# Altium schematic sheet Overview.SchDoc
size A3; SheetNumber: 1; SheetTotal: 20
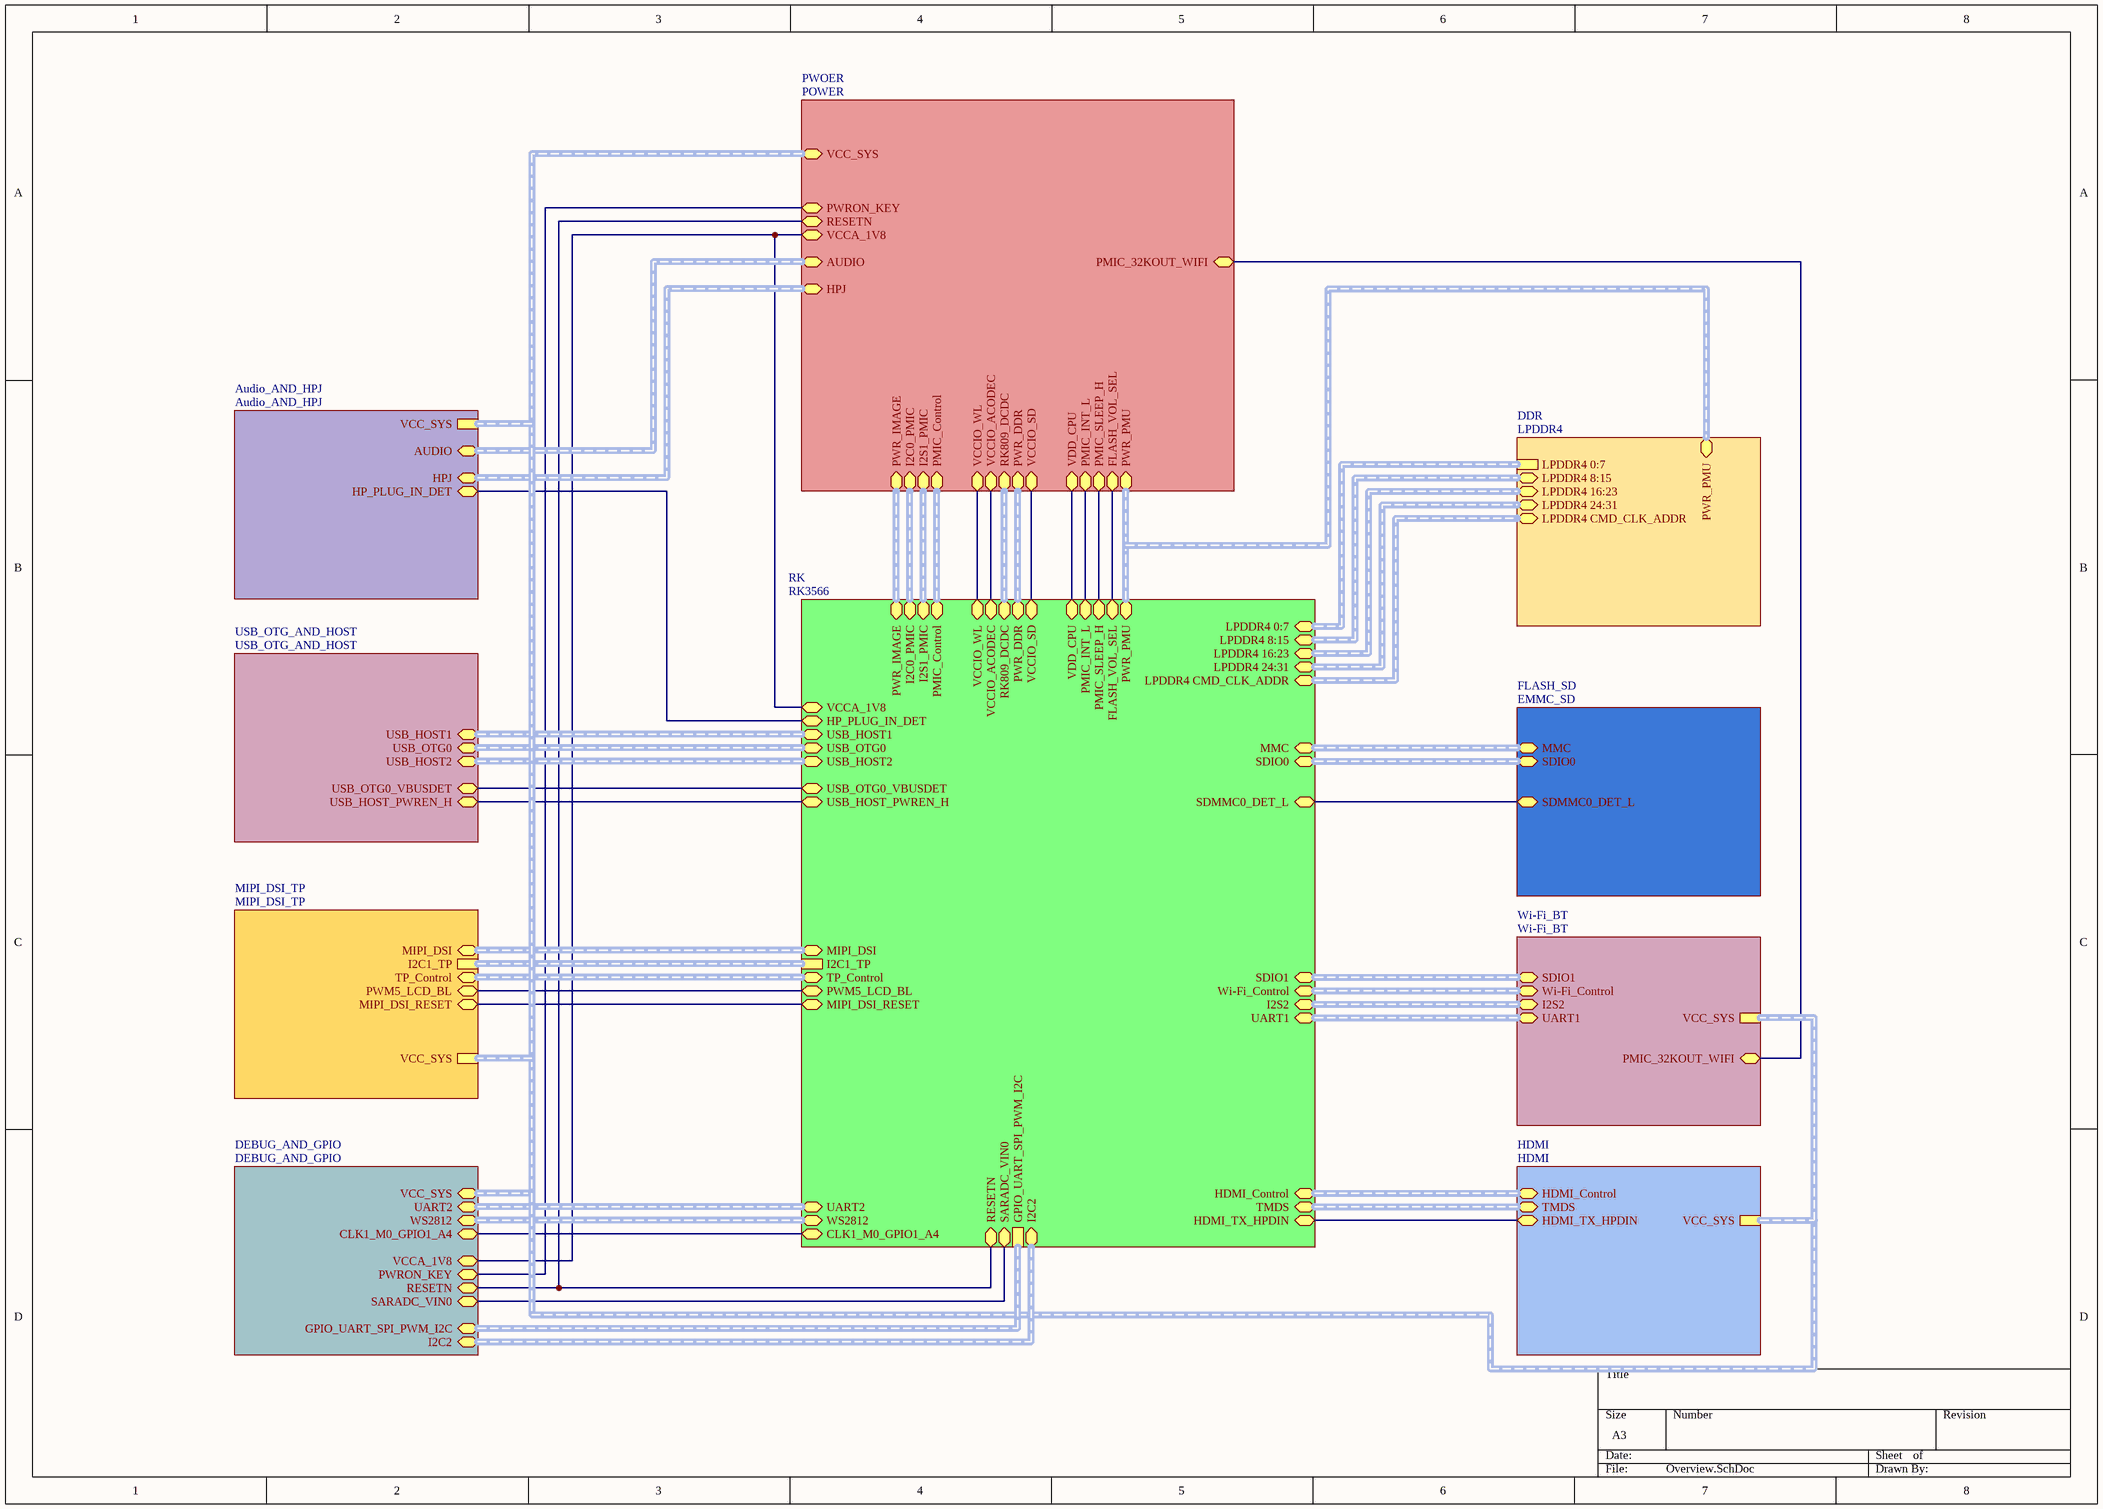
[diagram p0: Overview.SchDoc]

## Sub-sheets
Audio_AND_HPJ = Audio_AND_HPJ: AUDIO (bidir), HPJ (bidir), HP_PLUG_IN_DET (bidir), VCC_SYS
DDR = LPDDR4: LPDDR4 0:7, LPDDR4 8:15 (bidir), LPDDR4 16:23 (bidir), LPDDR4 24:31 (bidir), LPDDR4 CMD_CLK_ADDR (bidir), PWR_PMU (bidir)
DEBUG_AND_GPIO = DEBUG_AND_GPIO: UART2 (bidir), WS2812 (bidir), CLK1_M0_GPIO1_A4 (bidir), RESETN (bidir), PWRON_KEY (bidir), SARADC_VIN0 (bidir), VCC_SYS (bidir), VCCA_1V8 (bidir), GPIO_UART_SPI_PWM_I2C (bidir), I2C2 (bidir)
FLASH_SD = EMMC_SD: MMC (bidir), SDIO0 (bidir), SDMMC0_DET_L (bidir)
HDMI = HDMI: TMDS (bidir), HDMI_Control (bidir), HDMI_TX_HPDIN (bidir), VCC_SYS
MIPI_DSI_TP = MIPI_DSI_TP: MIPI_DSI (bidir), I2C1_TP, PWM5_LCD_BL (bidir), MIPI_DSI_RESET (bidir), TP_Control (bidir), VCC_SYS
PWOER = POWER: I2S1_PMIC (bidir), PMIC_Control (bidir), I2C0_PMIC (bidir), AUDIO (bidir), RK809_DCDC (bidir), PMIC_32KOUT_WIFI (bidir), HPJ (bidir), PWR_DDR (bidir), VCCIO_SD (bidir), VCCIO_ACODEC (bidir), VCCIO_WL (bidir), PWR_IMAGE (bidir), VDD_CPU (bidir), PMIC_INT_L (bidir), PMIC_SLEEP_H (bidir), FLASH_VOL_SEL (bidir), PWR_PMU (bidir), PWRON_KEY (bidir), VCC_SYS (bidir), RESETN (bidir), VCCA_1V8 (bidir)
RK = RK3566: LPDDR4 0:7 (bidir), LPDDR4 8:15 (bidir), LPDDR4 16:23 (bidir), LPDDR4 24:31 (bidir), LPDDR4 CMD_CLK_ADDR (bidir), MIPI_DSI (bidir), MMC (bidir), SDIO0 (bidir), SDMMC0_DET_L (bidir), I2C1_TP, TP_Control (bidir), PWM5_LCD_BL (bidir), MIPI_DSI_RESET (bidir), SDIO1 (bidir), Wi-Fi_Control (bidir), I2S2 (bidir), UART1 (bidir), HDMI_Control (bidir), TMDS (bidir), HDMI_TX_HPDIN (bidir), I2S1_PMIC (bidir), PMIC_Control (bidir), I2C0_PMIC (bidir), RK809_DCDC (bidir), UART2 (bidir), USB_OTG0 (bidir), USB_HOST2 (bidir), USB_OTG0_VBUSDET (bidir), USB_HOST_PWREN_H (bidir), USB_HOST1 (bidir), HP_PLUG_IN_DET (bidir), PWR_DDR (bidir), VCCIO_SD (bidir), VCCIO_ACODEC (bidir), VCCIO_WL (bidir), WS2812 (bidir), CLK1_M0_GPIO1_A4 (bidir), PWR_IMAGE (bidir), VDD_CPU (bidir), PMIC_INT_L (bidir), PMIC_SLEEP_H (bidir), FLASH_VOL_SEL (bidir), PWR_PMU (bidir), RESETN (bidir), SARADC_VIN0 (bidir), VCCA_1V8 (bidir), GPIO_UART_SPI_PWM_I2C, I2C2 (bidir)
USB_OTG_AND_HOST = USB_OTG_AND_HOST: USB_OTG0 (bidir), USB_HOST2 (bidir), USB_OTG0_VBUSDET (bidir), USB_HOST_PWREN_H (bidir), USB_HOST1 (bidir)
Wi-Fi_BT = Wi-Fi_BT: SDIO1 (bidir), Wi-Fi_Control (bidir), I2S2 (bidir), UART1 (bidir), PMIC_32KOUT_WIFI (bidir), VCC_SYS

## Nets
(unnamed): sheet RK/SDMMC0_DET_L, sheet FLASH_SD/SDMMC0_DET_L
(unnamed): sheet RK/PWM5_LCD_BL, sheet MIPI_DSI_TP/PWM5_LCD_BL
(unnamed): sheet RK/MIPI_DSI_RESET, sheet MIPI_DSI_TP/MIPI_DSI_RESET
(unnamed): sheet RK/HDMI_TX_HPDIN, sheet HDMI/HDMI_TX_HPDIN
(unnamed): sheet RK/USB_OTG0_VBUSDET, sheet USB_OTG_AND_HOST/USB_OTG0_VBUSDET
(unnamed): sheet RK/USB_HOST_PWREN_H, sheet USB_OTG_AND_HOST/USB_HOST_PWREN_H
(unnamed): sheet RK/HP_PLUG_IN_DET, sheet Audio_AND_HPJ/HP_PLUG_IN_DET
(unnamed): sheet RK/VCCIO_SD, sheet PWOER/VCCIO_SD
(unnamed): sheet RK/VCCIO_ACODEC, sheet PWOER/VCCIO_ACODEC
(unnamed): sheet RK/VCCIO_WL, sheet PWOER/VCCIO_WL
(unnamed): sheet RK/CLK1_M0_GPIO1_A4, sheet DEBUG_AND_GPIO/CLK1_M0_GPIO1_A4
(unnamed): sheet RK/VDD_CPU, sheet PWOER/VDD_CPU
(unnamed): sheet RK/PMIC_INT_L, sheet PWOER/PMIC_INT_L
(unnamed): sheet RK/PMIC_SLEEP_H, sheet PWOER/PMIC_SLEEP_H
(unnamed): sheet RK/FLASH_VOL_SEL, sheet PWOER/FLASH_VOL_SEL
(unnamed): sheet RK/RESETN, sheet PWOER/RESETN, sheet DEBUG_AND_GPIO/RESETN
(unnamed): sheet RK/SARADC_VIN0, sheet DEBUG_AND_GPIO/SARADC_VIN0
(unnamed): sheet RK/VCCA_1V8, sheet PWOER/VCCA_1V8, sheet DEBUG_AND_GPIO/VCCA_1V8
(unnamed): sheet Wi-Fi_BT/PMIC_32KOUT_WIFI, sheet PWOER/PMIC_32KOUT_WIFI
(unnamed): sheet PWOER/PWRON_KEY, sheet DEBUG_AND_GPIO/PWRON_KEY

## Buses and harness runs
harness sheet Audio_AND_HPJ/AUDIO = sheet PWOER/AUDIO
harness sheet Audio_AND_HPJ/HPJ = sheet PWOER/HPJ
harness sheet Audio_AND_HPJ/VCC_SYS = sheet DEBUG_AND_GPIO/VCC_SYS = sheet HDMI/VCC_SYS = sheet MIPI_DSI_TP/VCC_SYS = sheet PWOER/VCC_SYS = sheet Wi-Fi_BT/VCC_SYS
harness sheet DDR/LPDDR4 0:7 = sheet RK/LPDDR4 0:7
harness sheet DDR/LPDDR4 8:15 = sheet RK/LPDDR4 8:15
harness sheet DDR/LPDDR4 16:23 = sheet RK/LPDDR4 16:23
harness sheet DDR/LPDDR4 24:31 = sheet RK/LPDDR4 24:31
harness sheet DDR/LPDDR4 CMD_CLK_ADDR = sheet RK/LPDDR4 CMD_CLK_ADDR
harness sheet DDR/PWR_PMU = sheet PWOER/PWR_PMU = sheet RK/PWR_PMU
harness sheet DEBUG_AND_GPIO/GPIO_UART_SPI_PWM_I2C = sheet RK/GPIO_UART_SPI_PWM_I2C
harness sheet DEBUG_AND_GPIO/I2C2 = sheet RK/I2C2
harness sheet DEBUG_AND_GPIO/UART2 = sheet RK/UART2
harness sheet DEBUG_AND_GPIO/WS2812 = sheet RK/WS2812
harness sheet FLASH_SD/MMC = sheet RK/MMC
harness sheet FLASH_SD/SDIO0 = sheet RK/SDIO0
harness sheet HDMI/HDMI_Control = sheet RK/HDMI_Control
harness sheet HDMI/TMDS = sheet RK/TMDS
harness sheet MIPI_DSI_TP/I2C1_TP = sheet RK/I2C1_TP
harness sheet MIPI_DSI_TP/MIPI_DSI = sheet RK/MIPI_DSI
harness sheet MIPI_DSI_TP/TP_Control = sheet RK/TP_Control
harness sheet PWOER/I2C0_PMIC = sheet RK/I2C0_PMIC
harness sheet PWOER/I2S1_PMIC = sheet RK/I2S1_PMIC
harness sheet PWOER/PMIC_Control = sheet RK/PMIC_Control
harness sheet PWOER/PWR_DDR = sheet RK/PWR_DDR
harness sheet PWOER/PWR_IMAGE = sheet RK/PWR_IMAGE
harness sheet PWOER/RK809_DCDC = sheet RK/RK809_DCDC
harness sheet RK/I2S2 = sheet Wi-Fi_BT/I2S2
harness sheet RK/SDIO1 = sheet Wi-Fi_BT/SDIO1
harness sheet RK/UART1 = sheet Wi-Fi_BT/UART1
harness sheet RK/USB_HOST1 = sheet USB_OTG_AND_HOST/USB_HOST1
harness sheet RK/USB_HOST2 = sheet USB_OTG_AND_HOST/USB_HOST2
harness sheet RK/USB_OTG0 = sheet USB_OTG_AND_HOST/USB_OTG0
harness sheet RK/Wi-Fi_Control = sheet Wi-Fi_BT/Wi-Fi_Control